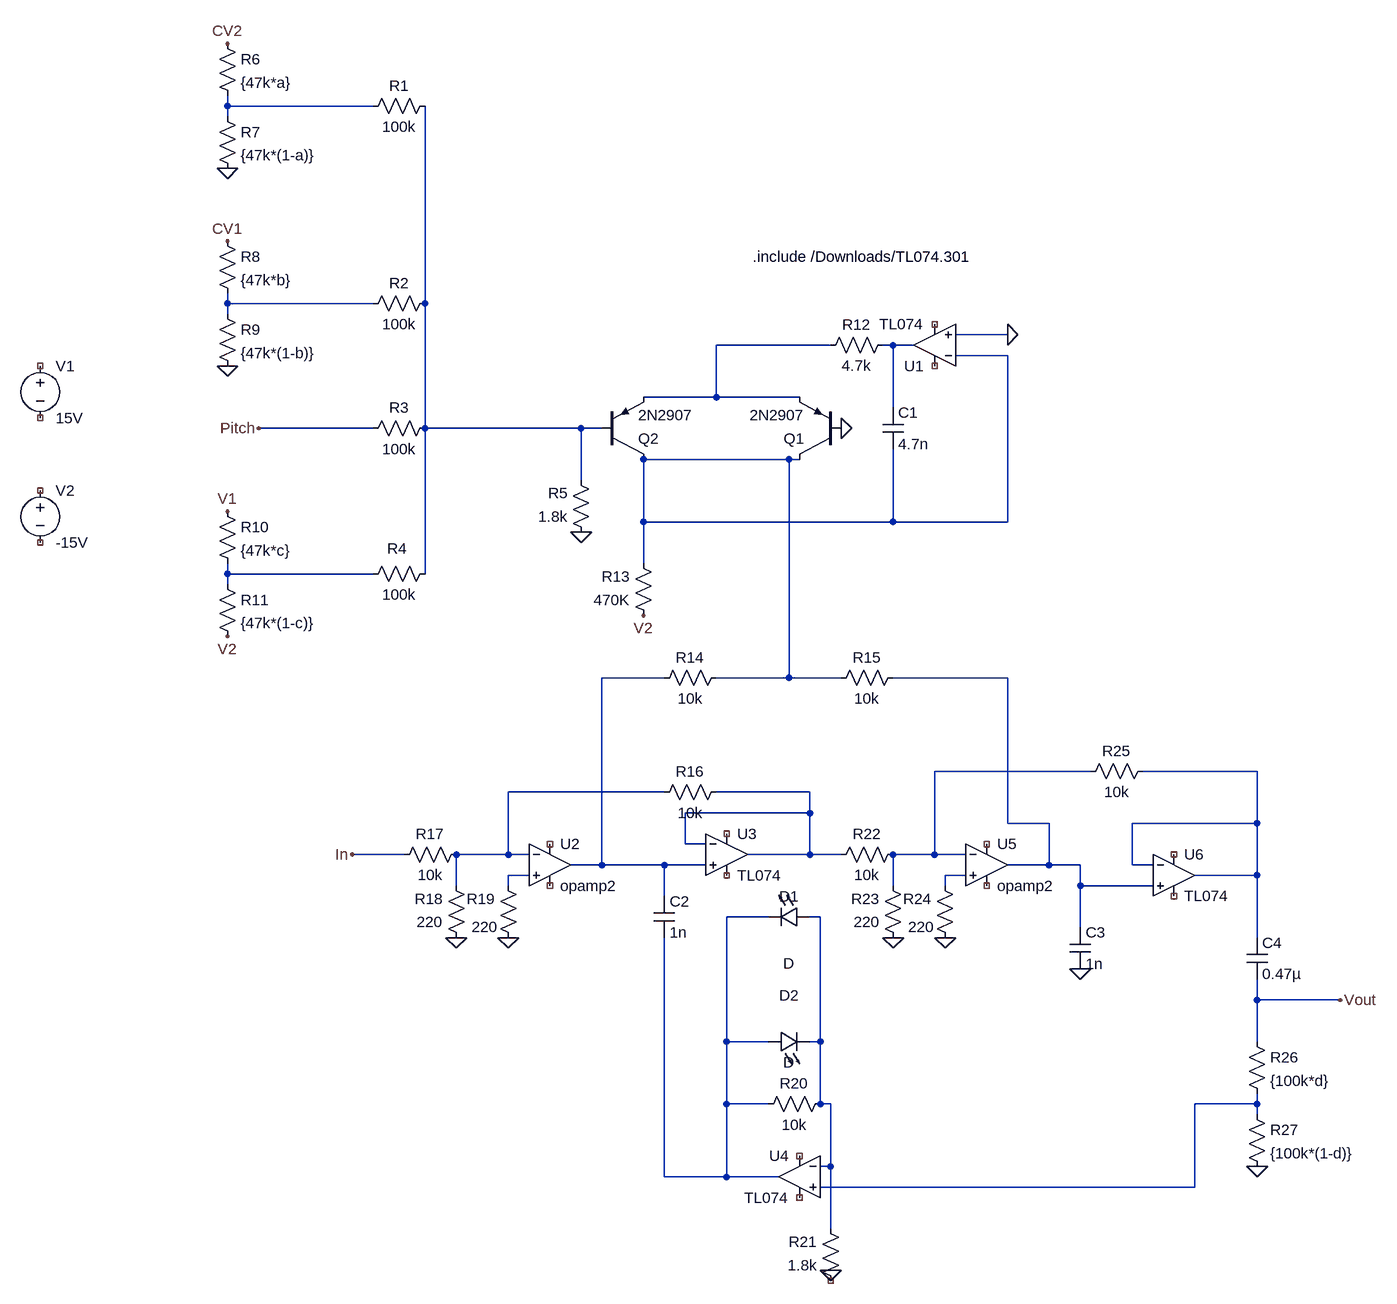
[diagram p0: schematic VCF.asc]
VCF.asc, the LTspice schematic file:
Version 4
SHEET 1 1524 1944
WIRE -256 128 -256 112
WIRE -32 128 -256 128
WIRE -256 144 -256 128
WIRE -256 432 -256 416
WIRE -32 432 -256 432
WIRE 48 432 48 128
WIRE -256 448 -256 432
WIRE 944 480 864 480
WIRE 672 496 496 496
WIRE 768 496 752 496
WIRE 800 496 768 496
WIRE 944 512 864 512
WIRE 496 576 496 496
WIRE 496 576 384 576
WIRE 624 576 496 576
WIRE 768 592 768 496
WIRE -32 624 -208 624
WIRE 48 624 48 432
WIRE 288 624 48 624
WIRE 320 624 288 624
WIRE 608 672 384 672
WIRE 624 672 608 672
WIRE 288 704 288 624
WIRE 384 768 384 672
WIRE 768 768 768 656
WIRE 768 768 384 768
WIRE 944 768 944 512
WIRE 944 768 768 768
WIRE 384 832 384 768
WIRE -256 848 -256 832
WIRE -32 848 -256 848
WIRE 48 848 48 624
WIRE -256 864 -256 848
WIRE 416 1008 320 1008
WIRE 608 1008 608 672
WIRE 608 1008 496 1008
WIRE 688 1008 608 1008
WIRE 944 1008 768 1008
WIRE 1072 1152 832 1152
WIRE 1328 1152 1152 1152
WIRE 416 1184 176 1184
WIRE 640 1184 496 1184
WIRE 640 1216 640 1184
WIRE 640 1216 448 1216
WIRE 944 1232 944 1008
WIRE 1008 1232 944 1232
WIRE 1328 1232 1328 1152
WIRE 1328 1232 1136 1232
WIRE 448 1264 448 1216
WIRE 480 1264 448 1264
WIRE 16 1280 -64 1280
WIRE 176 1280 176 1184
WIRE 176 1280 96 1280
WIRE 208 1280 176 1280
WIRE 640 1280 640 1216
WIRE 640 1280 544 1280
WIRE 688 1280 640 1280
WIRE 832 1280 832 1152
WIRE 832 1280 768 1280
WIRE 880 1280 832 1280
WIRE 320 1296 320 1008
WIRE 320 1296 272 1296
WIRE 416 1296 320 1296
WIRE 480 1296 416 1296
WIRE 1008 1296 1008 1232
WIRE 1008 1296 944 1296
WIRE 1056 1296 1008 1296
WIRE 1136 1296 1136 1232
WIRE 1168 1296 1136 1296
WIRE 208 1312 176 1312
WIRE 880 1312 848 1312
WIRE 1328 1312 1328 1232
WIRE 1328 1312 1232 1312
WIRE 96 1328 96 1280
WIRE 176 1328 176 1312
WIRE 768 1328 768 1280
WIRE 848 1328 848 1312
WIRE 1056 1328 1056 1296
WIRE 1168 1328 1056 1328
WIRE 416 1344 416 1296
WIRE 576 1376 512 1376
WIRE 656 1376 640 1376
WIRE 1056 1392 1056 1328
WIRE 1328 1408 1328 1312
WIRE 1328 1504 1328 1472
WIRE 1456 1504 1328 1504
WIRE 512 1568 512 1376
WIRE 576 1568 512 1568
WIRE 656 1568 656 1376
WIRE 656 1568 640 1568
WIRE 1328 1568 1328 1504
WIRE 512 1664 512 1568
WIRE 576 1664 512 1664
WIRE 656 1664 656 1568
WIRE 672 1664 656 1664
WIRE 1328 1664 1328 1648
WIRE 1328 1664 1232 1664
WIRE 1328 1680 1328 1664
WIRE 672 1760 672 1664
WIRE 672 1760 656 1760
WIRE 416 1776 416 1408
WIRE 512 1776 512 1664
WIRE 512 1776 416 1776
WIRE 592 1776 512 1776
WIRE 1232 1792 1232 1664
WIRE 1232 1792 656 1792
WIRE 672 1856 672 1760
FLAG -256 32 CV2
FLAG -256 224 0
FLAG -256 336 CV1
FLAG -256 528 0
FLAG -256 752 V1
FLAG -256 944 V2
FLAG -208 624 Pitch
FLAG 288 784 0
FLAG 688 624 0
FLAG 384 912 V2
FLAG 944 480 0
FLAG -64 1280 In
FLAG 96 1408 0
FLAG 176 1408 0
FLAG 672 1920 0
FLAG 768 1408 0
FLAG 848 1408 0
FLAG 1056 1456 0
FLAG 1328 1760 0
FLAG 1456 1504 Vout
SYMBOL res 64 112 R90
WINDOW 0 0 56 VBottom 2
WINDOW 3 32 56 VTop 2
SYMATTR InstName R1
SYMATTR Value 100k
SYMBOL res 64 416 R90
WINDOW 0 0 56 VBottom 2
WINDOW 3 32 56 VTop 2
SYMATTR InstName R2
SYMATTR Value 100k
SYMBOL res 64 608 R90
WINDOW 0 0 56 VBottom 2
WINDOW 3 32 56 VTop 2
SYMATTR InstName R3
SYMATTR Value 100k
SYMBOL res 64 832 R90
WINDOW 0 -7 59 VBottom 2
WINDOW 3 32 56 VTop 2
SYMATTR InstName R4
SYMATTR Value 100k
SYMBOL res 304 800 R180
WINDOW 0 36 76 Left 2
WINDOW 3 36 40 Left 2
SYMATTR InstName R5
SYMATTR Value 1.8k
SYMBOL res -272 16 R0
SYMATTR InstName R6
SYMATTR Value {47k*a}
SYMBOL res -272 128 R0
SYMATTR InstName R7
SYMATTR Value {47k*(1-a)}
SYMBOL res -272 320 R0
SYMATTR InstName R8
SYMATTR Value {47k*b}
SYMBOL res -272 432 R0
SYMATTR InstName R9
SYMATTR Value {47k*(1-b)}
SYMBOL res -272 736 R0
SYMATTR InstName R10
SYMATTR Value {47k*c}
SYMBOL res -272 848 R0
SYMATTR InstName R11
SYMATTR Value {47k*(1-c)}
SYMBOL voltage -544 512 R0
SYMATTR InstName V1
SYMATTR Value 15V
SYMBOL voltage -544 704 R0
SYMATTR InstName V2
SYMATTR Value -15V
SYMBOL pnp 688 672 R180
SYMATTR InstName Q1
SYMATTR Value 2N2907
SYMBOL pnp 320 672 M180
SYMATTR InstName Q2
SYMATTR Value 2N2907
SYMBOL Opamps/opamp2 832 560 R180
SYMATTR InstName U1
SYMATTR Value TL074
SYMBOL res 768 480 R90
WINDOW 0 0 56 VBottom 2
WINDOW 3 32 56 VTop 2
SYMATTR InstName R12
SYMATTR Value 4.7k
SYMBOL cap 752 592 R0
SYMATTR InstName C1
SYMATTR Value 4.7n
SYMBOL res 400 928 R180
WINDOW 0 36 76 Left 2
WINDOW 3 36 40 Left 2
SYMATTR InstName R13
SYMATTR Value 470K
SYMBOL res 512 992 R90
WINDOW 0 0 56 VBottom 2
WINDOW 3 32 56 VTop 2
SYMATTR InstName R14
SYMATTR Value 10k
SYMBOL res 784 992 R90
WINDOW 0 0 56 VBottom 2
WINDOW 3 32 56 VTop 2
SYMATTR InstName R15
SYMATTR Value 10k
SYMBOL res 512 1168 R90
WINDOW 0 0 56 VBottom 2
WINDOW 3 32 56 VTop 2
SYMATTR InstName R16
SYMATTR Value 10k
SYMBOL res 112 1264 R90
WINDOW 0 0 56 VBottom 2
WINDOW 3 32 56 VTop 2
SYMATTR InstName R17
SYMATTR Value 10k
SYMBOL Opamps/opamp2 240 1232 R0
SYMATTR InstName U2
SYMBOL res 112 1424 R180
WINDOW 0 36 76 Left 2
WINDOW 3 36 40 Left 2
SYMATTR InstName R18
SYMATTR Value 220
SYMBOL res 192 1424 R180
WINDOW 0 36 76 Left 2
WINDOW 3 32 33 Left 2
SYMATTR InstName R19
SYMATTR Value 220
SYMBOL Opamps/opamp2 512 1216 R0
SYMATTR InstName U3
SYMATTR Value TL074
SYMBOL cap 400 1344 R0
SYMATTR InstName C2
SYMATTR Value 1n
SYMBOL Opamps/opamp2 624 1712 M0
SYMATTR InstName U4
SYMATTR Value TL074
SYMBOL res 672 1648 R90
WINDOW 0 0 56 VBottom 2
WINDOW 3 32 56 VTop 2
SYMATTR InstName R20
SYMATTR Value 10k
SYMBOL LED 640 1360 R90
WINDOW 0 0 32 VBottom 2
WINDOW 3 72 32 VTop 2
SYMATTR InstName D1
SYMBOL LED 576 1584 R270
WINDOW 0 72 32 VTop 2
WINDOW 3 0 32 VBottom 2
SYMATTR InstName D2
SYMBOL res 688 1952 R180
WINDOW 0 36 76 Left 2
WINDOW 3 36 40 Left 2
SYMATTR InstName R21
SYMATTR Value 1.8k
SYMBOL res 784 1264 R90
WINDOW 0 0 56 VBottom 2
WINDOW 3 32 56 VTop 2
SYMATTR InstName R22
SYMATTR Value 10k
SYMBOL Opamps/opamp2 912 1232 R0
SYMATTR InstName U5
SYMBOL res 784 1424 R180
WINDOW 0 36 76 Left 2
WINDOW 3 36 40 Left 2
SYMATTR InstName R23
SYMATTR Value 220
SYMBOL res 864 1424 R180
WINDOW 0 36 76 Left 2
WINDOW 3 32 33 Left 2
SYMATTR InstName R24
SYMATTR Value 220
SYMBOL cap 1040 1392 R0
SYMATTR InstName C3
SYMATTR Value 1n
SYMBOL res 1168 1136 R90
WINDOW 0 0 56 VBottom 2
WINDOW 3 32 56 VTop 2
SYMATTR InstName R25
SYMATTR Value 10k
SYMBOL Opamps/opamp2 1200 1248 R0
SYMATTR InstName U6
SYMATTR Value TL074
SYMBOL cap 1312 1408 R0
SYMATTR InstName C4
SYMATTR Value 0.47µ
SYMBOL res 1312 1552 R0
SYMATTR InstName R26
SYMATTR Value {100k*d}
SYMBOL res 1312 1664 R0
SYMATTR InstName R27
SYMATTR Value {100k*(1-d)}
TEXT 552 360 Left 2 !.include /Downloads/TL074.301

The netlist it stands for:
* VCF.asc
R1 N003 N001 100k
R2 N003 N002 100k
R3 N003 Pitch 100k
R4 N003 N007 100k
R5 0 N003 1.8k
R6 CV2 N001 {47k*a}
R7 N001 0 {47k*(1-a)}
R8 CV1 N002 {47k*b}
R9 N002 0 {47k*(1-b)}
R10 V1 N007 {47k*c}
R11 N007 V2 {47k*(1-c)}
V1 NC_01 NC_02 15V
V2 NC_03 NC_04 -15V
Q1 N006 0 N004 0 2N2907
Q2 N006 N003 N004 0 2N2907
XU1 0 N006 NC_05 NC_06 N005 TL074  ; pins In+ In- V+ V- OUT
R12 N005 N004 4.7k
C1 N005 N006 4.7n
R13 V2 N006 470K
R14 N006 N008 10k
R15 N009 N006 10k
R16 N013 N012 10k
R17 N012 In 10k
XU2 N014 N012 NC_07 NC_08 N008 opamp2  ; pins In+ In- V+ V- OUT
R18 0 N012 220
R19 0 N014 220
XU3 N008 N013 NC_09 NC_10 N013 TL074  ; pins In+ In- V+ V- OUT
C2 N008 N016 1n
XU4 N018 N017 NC_11 NC_12 N016 TL074  ; pins In+ In- V+ V- OUT
R20 N017 N016 10k
D1 N017 N016 D
D2 N016 N017 D
R21 NC_13 N017 1.8k
R22 N010 N013 10k
XU5 N015 N010 NC_14 NC_15 N009 opamp2  ; pins In+ In- V+ V- OUT
R23 0 N010 220
R24 0 N015 220
C3 N009 0 1n
R25 N011 N010 10k
XU6 N009 N011 NC_16 NC_17 N011 TL074  ; pins In+ In- V+ V- OUT
C4 N011 Vout 0.47µ
R26 Vout N018 {100k*d}
R27 N018 0 {100k*(1-d)}
.model D D
.lib standard.dio
.model NPN NPN
.model PNP PNP
.lib standard.bjt
.include /Downloads/TL074.301
.backanno
.end